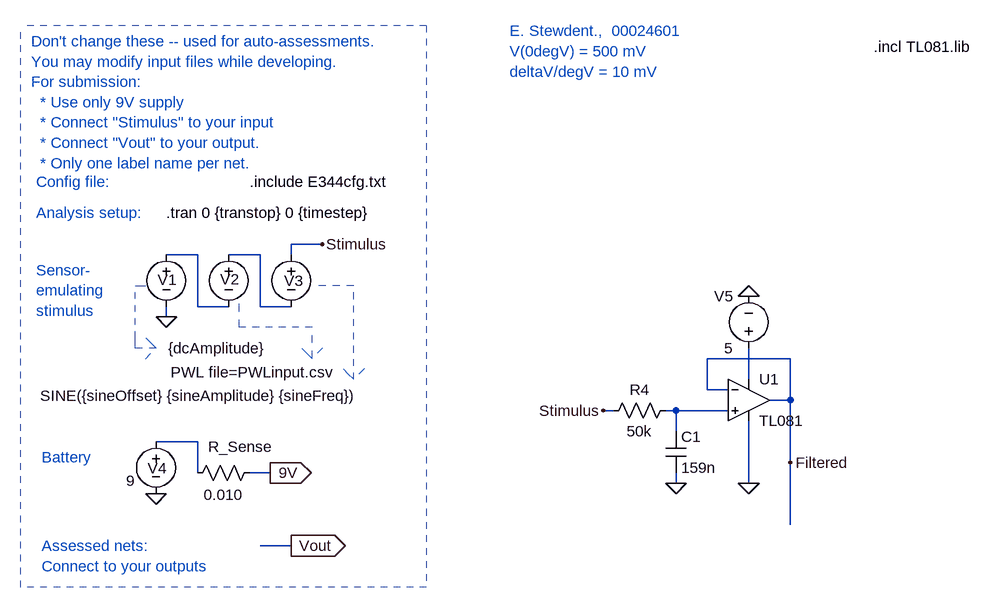
[diagram p0: schematic _Noninverting_1st_Order_TL081.asc]
_Noninverting_1st_Order_TL081.asc, the LTspice schematic file:
Version 4
SHEET 1 1824 680
WIRE -1840 -1072 -1888 -1072
WIRE -2032 -1056 -2080 -1056
WIRE -1936 -1056 -1984 -1056
WIRE -1888 -1056 -1888 -1072
WIRE -2032 -976 -2032 -1056
WIRE -1984 -976 -2032 -976
WIRE -1936 -976 -1936 -1056
WIRE -1888 -976 -1936 -976
WIRE -2080 -960 -2080 -976
WIRE -1120 -896 -1248 -896
WIRE -1184 -864 -1184 -912
WIRE -1248 -848 -1248 -896
WIRE -1216 -848 -1248 -848
WIRE -1120 -832 -1120 -896
WIRE -1120 -832 -1152 -832
WIRE -1392 -816 -1408 -816
WIRE -1296 -816 -1312 -816
WIRE -1216 -816 -1296 -816
WIRE -1296 -784 -1296 -816
WIRE -2032 -768 -2096 -768
WIRE -1120 -736 -1120 -832
WIRE -2032 -720 -2032 -768
WIRE -1920 -720 -1952 -720
WIRE -1296 -704 -1296 -720
WIRE -1184 -704 -1184 -800
WIRE -1120 -640 -1120 -736
WIRE -1888 -608 -1936 -608
FLAG -2080 -960 0
FLAG -1840 -1072 Stimulus
FLAG -1920 -720 9V
IOPIN -1920 -720 Out
FLAG -2096 -688 0
FLAG -1888 -608 Vout
IOPIN -1888 -608 Out
FLAG -1408 -816 Stimulus
FLAG -1120 -736 Filtered
FLAG -1184 -704 0
FLAG -1296 -704 0
FLAG -1184 -992 0
SYMBOL voltage -1984 -1072 R0
WINDOW 123 0 0 Left 0
WINDOW 39 0 0 Left 0
WINDOW 3 -89 197 Left 2
WINDOW 0 -13 54 Left 2
SYMATTR Value PWL file=PWLinput.csv
SYMATTR InstName V2
SYMBOL voltage -1888 -1072 R0
WINDOW 123 24 44 Left 2
WINDOW 39 0 0 Left 0
WINDOW 3 -386 233 Left 2
WINDOW 0 -11 56 Left 2
SYMATTR Value SINE({sineOffset} {sineAmplitude} {sineFreq})
SYMATTR InstName V3
SYMBOL voltage -2080 -1072 R0
WINDOW 123 0 0 Left 0
WINDOW 39 0 0 Left 0
WINDOW 3 3 160 Left 2
WINDOW 0 -13 55 Left 2
SYMATTR Value {dcAmplitude}
SYMATTR InstName V1
SYMBOL voltage -2096 -784 R0
WINDOW 123 24 44 Left 2
WINDOW 39 0 0 Left 0
WINDOW 3 -46 76 Left 2
WINDOW 0 -13 57 Left 2
SYMATTR Value 9
SYMATTR InstName V4
SYMBOL res -1936 -736 R90
WINDOW 0 -9 30 VBottom 2
WINDOW 3 34 56 VTop 2
SYMATTR InstName R_Sense
SYMATTR Value 0.010
SYMBOL res -1296 -832 R90
WINDOW 0 0 56 VBottom 2
WINDOW 3 32 56 VTop 2
SYMATTR InstName R4
SYMATTR Value 50k
SYMBOL cap -1312 -784 R0
SYMATTR InstName C1
SYMATTR Value 159n
SYMBOL Opamps\\opamp2 -1184 -896 R0
SYMATTR InstName U1
SYMATTR Value TL081
SYMBOL voltage -1184 -896 R180
WINDOW 0 24 96 Left 2
WINDOW 3 24 16 Left 2
WINDOW 123 0 0 Left 0
WINDOW 39 0 0 Left 0
SYMATTR InstName V5
SYMATTR Value 5
TEXT -2080 -1120 Left 2 !.tran 0 {transtop} 0 {timestep}
TEXT -1952 -1168 Left 2 !.include E344cfg.txt
TEXT -2288 -1384 Left 2 ;Don't change these -- used for auto-assessments.\nYou may modify input files while developing.\nFor submission: \n  * Use only 9V supply \n  * Connect "Stimulus" to your input\n  * Connect "Vout" to your output.\n  * Only one label name per net.
TEXT -2280 -1168 Left 2 ;Config file:
TEXT -2280 -1120 Left 2 ;Analysis setup:
TEXT -2272 -744 Left 2 ;Battery
TEXT -2280 -1032 Left 2 ;Sensor-\nemulating \nstimulus
TEXT -2272 -608 Left 2 ;Assessed nets:\nConnect to your outputs
TEXT -1552 -1400 Left 2 ;E. Stewdent.,  00024601\nV(0degV) = 500 mV\ndeltaV/degV = 10 mV
TEXT -992 -1376 Left 2 !.incl TL081.lib
LINE Normal -1792 -1008 -1856 -1008 2
LINE Normal -1792 -864 -1792 -1008 2
LINE Normal -1808 -880 -1792 -864 2
LINE Normal -1792 -864 -1808 -880 2
LINE Normal -1776 -880 -1792 -864 2
LINE Normal -2128 -1008 -2112 -1008 2
LINE Normal -2128 -928 -2128 -1008 2
LINE Normal -2128 -912 -2128 -928 2
LINE Normal -2096 -912 -2128 -912 2
LINE Normal -2112 -928 -2096 -912 2
LINE Normal -2096 -912 -2112 -928 2
LINE Normal -2112 -896 -2096 -912 2
LINE Normal -1968 -944 -1968 -992 2
LINE Normal -1856 -944 -1968 -944 2
LINE Normal -1856 -896 -1856 -944 2
LINE Normal -1872 -912 -1856 -896 2
LINE Normal -1856 -896 -1872 -912 2
LINE Normal -1840 -912 -1856 -896 2
LINE Normal -2304 -544 -2304 -1408 1
LINE Normal -1680 -1408 -1680 -544 1
LINE Normal -1680 -544 -2304 -544 1
LINE Normal -1680 -1408 -2304 -1408 1

The netlist it stands for:
* _Noninverting_1st_Order_TL081.asc
V2 N002 N001 PWL file=PWLinput.csv
V3 Stimulus N002 SINE({sineOffset} {sineAmplitude} {sineFreq})
V1 N001 0 {dcAmplitude}
V4 N005 0 9
R_Sense 9V N005 0.010
R4 N004 Stimulus 50k
C1 N004 0 159n
XU1 N004 Filtered N003 0 Filtered TL081  ; pins In+ In- V+ V- OUT
V5 N003 0 5
.tran 0 {transtop} 0 {timestep}
.include E344cfg.txt
* Don't change these -- used for auto-assessments.
* You may modify input files while developing.
* For submission:
*   * Use only 9V supply
*   * Connect "Stimulus" to your input
*   * Connect "Vout" to your output.
*   * Only one label name per net.
* Config file:
* Analysis setup:
* Battery
* Sensor-
* emulating
* stimulus
* Assessed nets:
* Connect to your outputs
* E. Stewdent.,  00024601
* V(0degV) = 500 mV
* deltaV/degV = 10 mV
.incl TL081.lib
.backanno
.end